# EAGLE schematic TestBench (EAGLE 6.5.0)
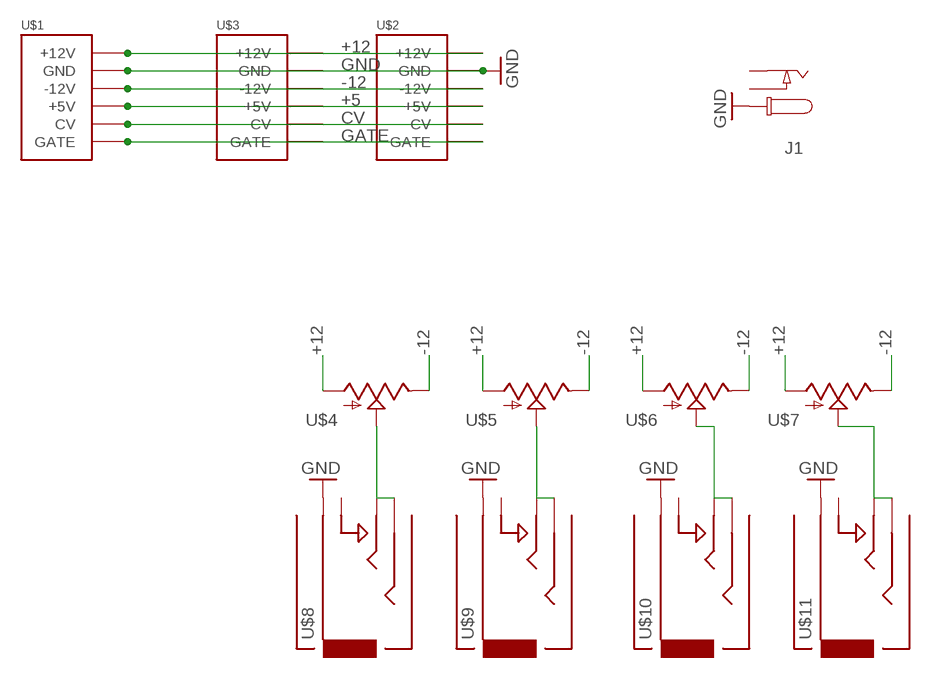
[diagram p0: schematic, sheet 1]

## Parts
J1  CON_DC_M-DC_PTH  [DC_BARREL_JACK_PTH_2MM]
U$1  POWER  [POWER_16]
U$2  POWER  [POWER_16]
U$3  POWER  [POWER_16]
U$4  POTZEPHPOT  [OG-POTS_ALPS_POT_VERTICAL]
U$5  POTZEPHPOT  [OG-POTS_ALPS_POT_VERTICAL]
U$6  POTZEPHPOT  [OG-POTS_ALPS_POT_VERTICAL]
U$7  POTZEPHPOT  [OG-POTS_ALPS_POT_VERTICAL]
U$8  AUDIO-JACKOUTPUT  [3.5MM-JACK-SWITCH-13MM-OUTPUT]
U$9  AUDIO-JACKOUTPUT  [3.5MM-JACK-SWITCH-13MM-OUTPUT]
U$10  AUDIO-JACKOUTPUT  [3.5MM-JACK-SWITCH-13MM-OUTPUT]
U$11  AUDIO-JACKOUTPUT  [3.5MM-JACK-SWITCH-13MM-OUTPUT]

## Nets
+5: U$1.11(+5V) U$1.12(+5V) U$2.11(+5V) U$2.12(+5V) U$3.11(+5V) U$3.12(+5V)
+12: U$1.9(+12V) U$1.10(+12V) U$2.9(+12V) U$2.10(+12V) U$3.9(+12V) U$3.10(+12V) U$4.P$3(A) U$5.P$3(A) U$6.P$3(A) U$7.P$3(A)
-12: U$1.1(-12V) U$1.2(-12V) U$2.1(-12V) U$2.2(-12V) U$3.1(-12V) U$3.2(-12V) U$4.P$1(E) U$5.P$1(E) U$6.P$1(E) U$7.P$1(E)
CV: U$1.13(CV) U$1.14(CV) U$2.13(CV) U$2.14(CV) U$3.13(CV) U$3.14(CV)
GATE: U$1.15(GATE) U$1.16(GATE) U$2.15(GATE) U$2.16(GATE) U$3.15(GATE) U$3.16(GATE)
GND: J1.P1 U$1.3(GND) U$1.4(GND) U$1.5(GND) U$1.6(GND) U$1.7(GND) U$1.8(GND) U$2.3(GND) U$2.4(GND) U$2.5(GND) U$2.6(GND) U$2.7(GND) U$2.8(GND) U$3.3(GND) U$3.4(GND) U$3.5(GND) U$3.6(GND) U$3.7(GND) U$3.8(GND) U$8.RING@1(RING) U$8.RING@2(RING) U$9.RING@1(RING) U$9.RING@2(RING) U$10.RING@1(RING) U$10.RING@2(RING) U$11.RING@1(RING) U$11.RING@2(RING)
N$2: U$4.P$2(S) U$8.SECOND@1(SECOND) U$8.SECOND@2(SECOND) U$8.TIP@1(TIP) U$8.TIP@2(TIP)
N$7: U$5.P$2(S) U$9.SECOND@1(SECOND) U$9.SECOND@2(SECOND) U$9.TIP@1(TIP) U$9.TIP@2(TIP)
N$8: U$6.P$2(S) U$10.SECOND@1(SECOND) U$10.SECOND@2(SECOND) U$10.TIP@1(TIP) U$10.TIP@2(TIP)
N$9: U$7.P$2(S) U$11.SECOND@1(SECOND) U$11.SECOND@2(SECOND) U$11.TIP@1(TIP) U$11.TIP@2(TIP)
Unconnected: J1.P2(P3) J1.P3(P2) U$8.SWITCH@1(SWITCH) U$8.SWITCH@2(SWITCH) U$9.SWITCH@1(SWITCH) U$9.SWITCH@2(SWITCH) U$10.SWITCH@1(SWITCH) U$10.SWITCH@2(SWITCH) U$11.SWITCH@1(SWITCH) U$11.SWITCH@2(SWITCH)

## Library data of the parts
J1 = dp_devices:CON_DC_M: DC power connector
U$1-U$3 = EurorackModularParts:POWER
U$4-U$7 = EurorackModularParts:POT
U$8-U$11 = EurorackModularParts:AUDIO-JACK: Switching Mono 3.5mm Audio Jack from Erthenvar.